# Altium schematic sheet led.SchDoc
size A0
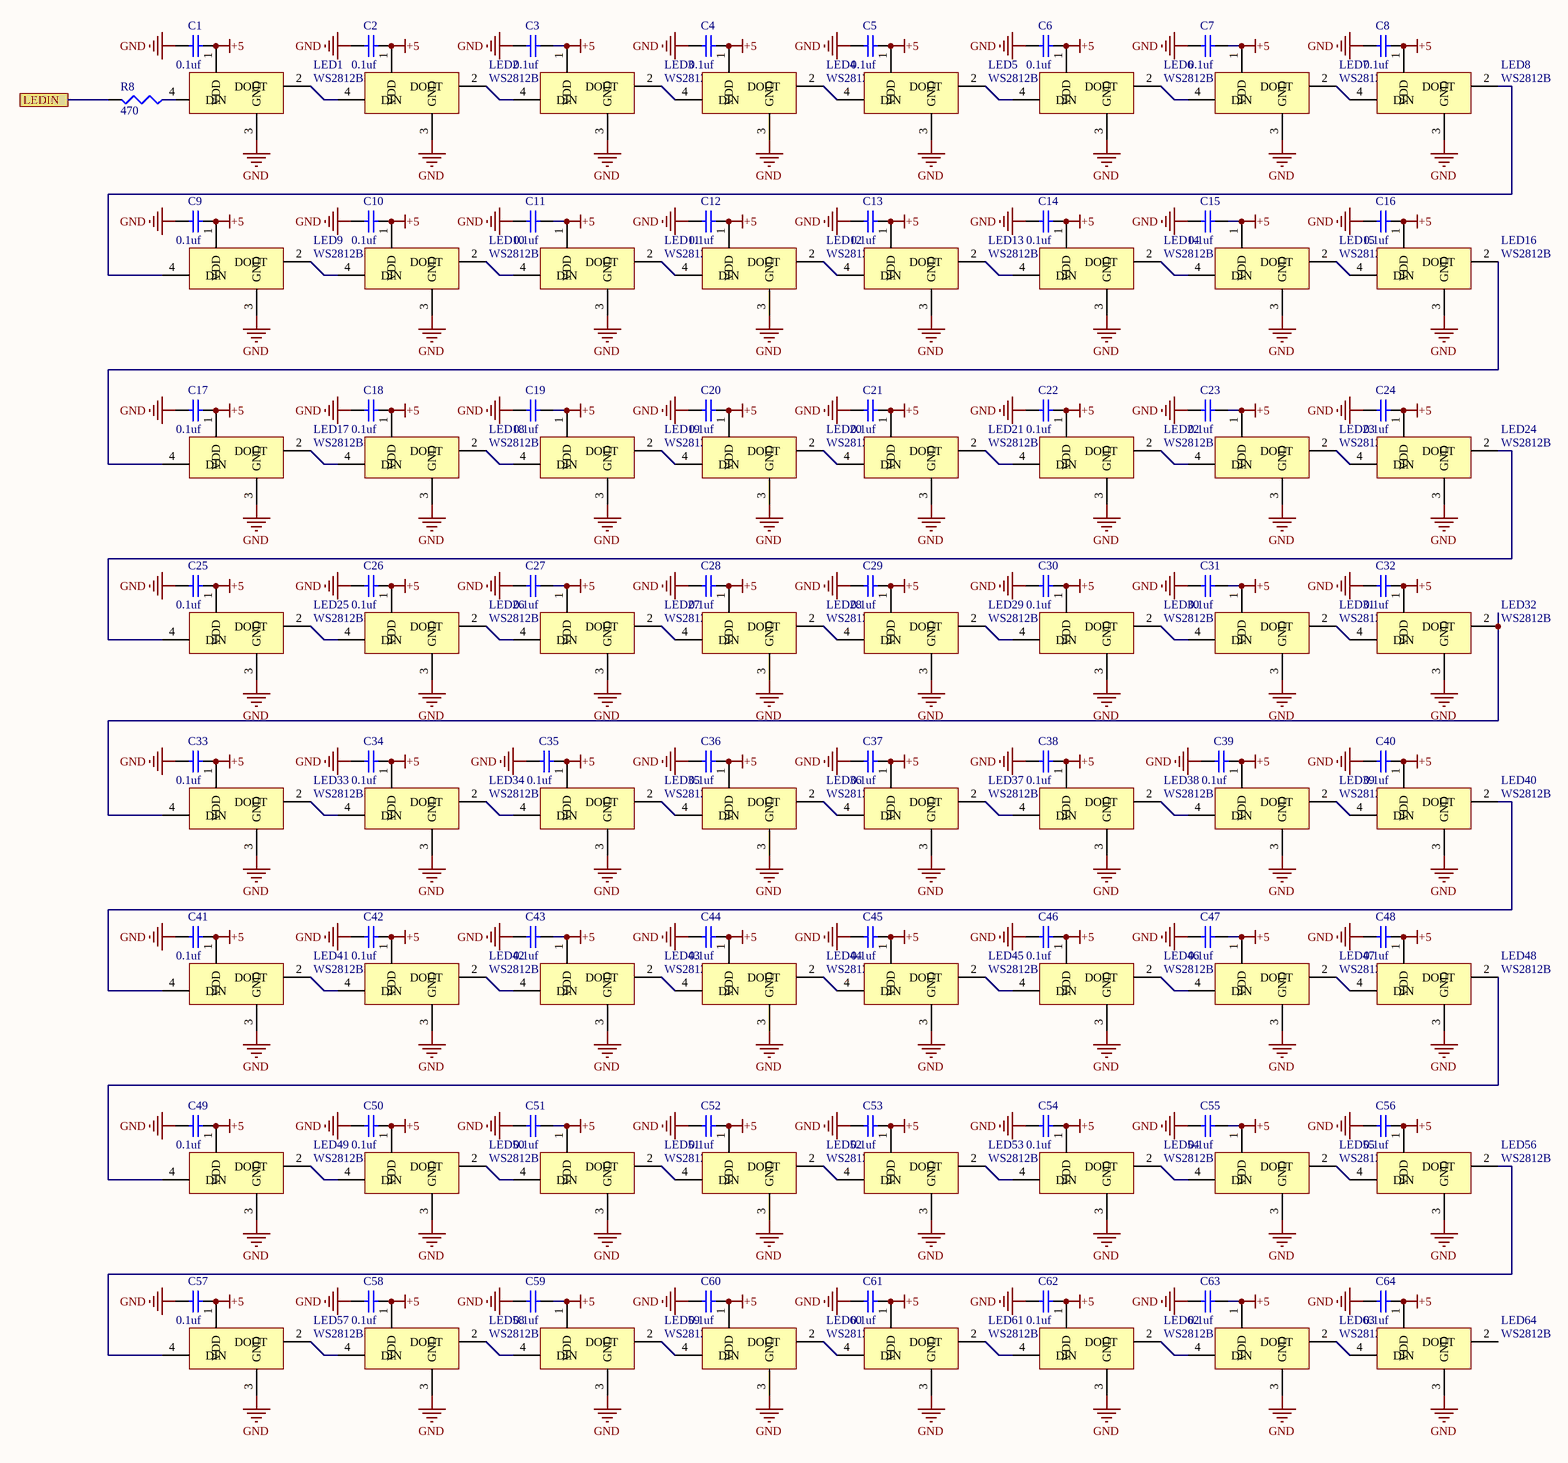
[diagram p0: led.SchDoc]

## Parts
C1  value 0.1uf  [C1206]  (hidden comment: Cap Semi)
C2  value 0.1uf  [C1206]  (hidden comment: Cap Semi)
C3  value 0.1uf  [C1206]  (hidden comment: Cap Semi)
C4  value 0.1uf  [C1206]  (hidden comment: Cap Semi)
C5  value 0.1uf  [C1206]  (hidden comment: Cap Semi)
C6  value 0.1uf  [C1206]  (hidden comment: Cap Semi)
C7  value 0.1uf  [C1206]  (hidden comment: Cap Semi)
C8  value 0.1uf  [C1206]  (hidden comment: Cap Semi)
C9  value 0.1uf  [C1206]  (hidden comment: Cap Semi)
C10  value 0.1uf  [C1206]  (hidden comment: Cap Semi)
C11  value 0.1uf  [C1206]  (hidden comment: Cap Semi)
C12  value 0.1uf  [C1206]  (hidden comment: Cap Semi)
C13  value 0.1uf  [C1206]  (hidden comment: Cap Semi)
C14  value 0.1uf  [C1206]  (hidden comment: Cap Semi)
C15  value 0.1uf  [C1206]  (hidden comment: Cap Semi)
C16  value 0.1uf  [C1206]  (hidden comment: Cap Semi)
C17  value 0.1uf  [C1206]  (hidden comment: Cap Semi)
C18  value 0.1uf  [C1206]  (hidden comment: Cap Semi)
C19  value 0.1uf  [C1206]  (hidden comment: Cap Semi)
C20  value 0.1uf  [C1206]  (hidden comment: Cap Semi)
C21  value 0.1uf  [C1206]  (hidden comment: Cap Semi)
C22  value 0.1uf  [C1206]  (hidden comment: Cap Semi)
C23  value 0.1uf  [C1206]  (hidden comment: Cap Semi)
C24  value 0.1uf  [C1206]  (hidden comment: Cap Semi)
C25  value 0.1uf  [C1206]  (hidden comment: Cap Semi)
C26  value 0.1uf  [C1206]  (hidden comment: Cap Semi)
C27  value 0.1uf  [C1206]  (hidden comment: Cap Semi)
C28  value 0.1uf  [C1206]  (hidden comment: Cap Semi)
C29  value 0.1uf  [C1206]  (hidden comment: Cap Semi)
C30  value 0.1uf  [C1206]  (hidden comment: Cap Semi)
C31  value 0.1uf  [C1206]  (hidden comment: Cap Semi)
C32  value 0.1uf  [C1206]  (hidden comment: Cap Semi)
C33  value 0.1uf  [C1206]  (hidden comment: Cap Semi)
C34  value 0.1uf  [C1206]  (hidden comment: Cap Semi)
C35  value 0.1uf  [C1206]  (hidden comment: Cap Semi)
C36  value 0.1uf  [C1206]  (hidden comment: Cap Semi)
C37  value 0.1uf  [C1206]  (hidden comment: Cap Semi)
C38  value 0.1uf  [C1206]  (hidden comment: Cap Semi)
C39  value 0.1uf  [C1206]  (hidden comment: Cap Semi)
C40  value 0.1uf  [C1206]  (hidden comment: Cap Semi)
C41  value 0.1uf  [C1206]  (hidden comment: Cap Semi)
C42  value 0.1uf  [C1206]  (hidden comment: Cap Semi)
C43  value 0.1uf  [C1206]  (hidden comment: Cap Semi)
C44  value 0.1uf  [C1206]  (hidden comment: Cap Semi)
C45  value 0.1uf  [C1206]  (hidden comment: Cap Semi)
C46  value 0.1uf  [C1206]  (hidden comment: Cap Semi)
C47  value 0.1uf  [C1206]  (hidden comment: Cap Semi)
C48  value 0.1uf  [C1206]  (hidden comment: Cap Semi)
C49  value 0.1uf  [C1206]  (hidden comment: Cap Semi)
C50  value 0.1uf  [C1206]  (hidden comment: Cap Semi)
C51  value 0.1uf  [C1206]  (hidden comment: Cap Semi)
C52  value 0.1uf  [C1206]  (hidden comment: Cap Semi)
C53  value 0.1uf  [C1206]  (hidden comment: Cap Semi)
C54  value 0.1uf  [C1206]  (hidden comment: Cap Semi)
C55  value 0.1uf  [C1206]  (hidden comment: Cap Semi)
C56  value 0.1uf  [C1206]  (hidden comment: Cap Semi)
C57  value 0.1uf  [C1206]  (hidden comment: Cap Semi)
C58  value 0.1uf  [C1206]  (hidden comment: Cap Semi)
C59  value 0.1uf  [C1206]  (hidden comment: Cap Semi)
C60  value 0.1uf  [C1206]  (hidden comment: Cap Semi)
C61  value 0.1uf  [C1206]  (hidden comment: Cap Semi)
C62  value 0.1uf  [C1206]  (hidden comment: Cap Semi)
C63  value 0.1uf  [C1206]  (hidden comment: Cap Semi)
C64  value 0.1uf  [C1206]  (hidden comment: Cap Semi)
LED1  WS2812B  [WS2812B]
LED2  WS2812B  [WS2812B]
LED3  WS2812B  [WS2812B]
LED4  WS2812B  [WS2812B]
LED5  WS2812B  [WS2812B]
LED6  WS2812B  [WS2812B]
LED7  WS2812B  [WS2812B]
LED8  WS2812B  [WS2812B]
LED9  WS2812B  [WS2812B]
LED10  WS2812B  [WS2812B]
LED11  WS2812B  [WS2812B]
LED12  WS2812B  [WS2812B]
LED13  WS2812B  [WS2812B]
LED14  WS2812B  [WS2812B]
LED15  WS2812B  [WS2812B]
LED16  WS2812B  [WS2812B]
LED17  WS2812B  [WS2812B]
LED18  WS2812B  [WS2812B]
LED19  WS2812B  [WS2812B]
LED20  WS2812B  [WS2812B]
LED21  WS2812B  [WS2812B]
LED22  WS2812B  [WS2812B]
LED23  WS2812B  [WS2812B]
LED24  WS2812B  [WS2812B]
LED25  WS2812B  [WS2812B]
LED26  WS2812B  [WS2812B]
LED27  WS2812B  [WS2812B]
LED28  WS2812B  [WS2812B]
LED29  WS2812B  [WS2812B]
LED30  WS2812B  [WS2812B]
LED31  WS2812B  [WS2812B]
LED32  WS2812B  [WS2812B]
LED33  WS2812B  [WS2812B]
LED34  WS2812B  [WS2812B]
LED35  WS2812B  [WS2812B]
LED36  WS2812B  [WS2812B]
LED37  WS2812B  [WS2812B]
LED38  WS2812B  [WS2812B]
LED39  WS2812B  [WS2812B]
LED40  WS2812B  [WS2812B]
LED41  WS2812B  [WS2812B]
LED42  WS2812B  [WS2812B]
LED43  WS2812B  [WS2812B]
LED44  WS2812B  [WS2812B]
LED45  WS2812B  [WS2812B]
LED46  WS2812B  [WS2812B]
LED47  WS2812B  [WS2812B]
LED48  WS2812B  [WS2812B]
LED49  WS2812B  [WS2812B]
LED50  WS2812B  [WS2812B]
LED51  WS2812B  [WS2812B]
LED52  WS2812B  [WS2812B]
LED53  WS2812B  [WS2812B]
LED54  WS2812B  [WS2812B]
LED55  WS2812B  [WS2812B]
LED56  WS2812B  [WS2812B]
LED57  WS2812B  [WS2812B]
LED58  WS2812B  [WS2812B]
LED59  WS2812B  [WS2812B]
LED60  WS2812B  [WS2812B]
LED61  WS2812B  [WS2812B]
LED62  WS2812B  [WS2812B]
LED63  WS2812B  [WS2812B]
LED64  WS2812B  [WS2812B]
R8  value 470  [C1206]  (hidden comment: res)

## Ports
LEDIN

## Nets
+5: C1.2 C2.2 C3.2 C4.2 C5.2 C6.2 C7.2 C8.2 C9.2 C10.2 C11.2 C12.2 C13.2 C14.2 C15.2 C16.2 C17.2 C18.2 C19.2 C20.2 C21.2 C22.2 C23.2 C24.2 C25.2 C26.2 C27.2 C28.2 C29.2 C30.2 C31.2 C32.2 C33.2 C34.2 C35.2 C36.2 C37.2 C38.2 C39.2 C40.2 C41.2 C42.2 C43.2 C44.2 C45.2 C46.2 C47.2 C48.2 C49.2 C50.2 C51.2 C52.2 C53.2 C54.2 C55.2 C56.2 C57.2 C58.2 C59.2 C60.2 C61.2 C62.2 C63.2 C64.2 LED1.1(VDD) LED2.1(VDD) LED3.1(VDD) LED4.1(VDD) LED5.1(VDD) LED6.1(VDD) LED7.1(VDD) LED8.1(VDD) LED9.1(VDD) LED10.1(VDD) LED11.1(VDD) LED12.1(VDD) LED13.1(VDD) LED14.1(VDD) LED15.1(VDD) LED16.1(VDD) LED17.1(VDD) LED18.1(VDD) LED19.1(VDD) LED20.1(VDD) LED21.1(VDD) LED22.1(VDD) LED23.1(VDD) LED24.1(VDD) LED25.1(VDD) LED26.1(VDD) LED27.1(VDD) LED28.1(VDD) LED29.1(VDD) LED30.1(VDD) LED31.1(VDD) LED32.1(VDD) LED33.1(VDD) LED34.1(VDD) LED35.1(VDD) LED36.1(VDD) LED37.1(VDD) LED38.1(VDD) LED39.1(VDD) LED40.1(VDD) LED41.1(VDD) LED42.1(VDD) LED43.1(VDD) LED44.1(VDD) LED45.1(VDD) LED46.1(VDD) LED47.1(VDD) LED48.1(VDD) LED49.1(VDD) LED50.1(VDD) LED51.1(VDD) LED52.1(VDD) LED53.1(VDD) LED54.1(VDD) LED55.1(VDD) LED56.1(VDD) LED57.1(VDD) LED58.1(VDD) LED59.1(VDD) LED60.1(VDD) LED61.1(VDD) LED62.1(VDD) LED63.1(VDD) LED64.1(VDD)
GND: C1.1 C2.1 C3.1 C4.1 C5.1 C6.1 C7.1 C8.1 C9.1 C10.1 C11.1 C12.1 C13.1 C14.1 C15.1 C16.1 C17.1 C18.1 C19.1 C20.1 C21.1 C22.1 C23.1 C24.1 C25.1 C26.1 C27.1 C28.1 C29.1 C30.1 C31.1 C32.1 C33.1 C34.1 C35.1 C36.1 C37.1 C38.1 C39.1 C40.1 C41.1 C42.1 C43.1 C44.1 C45.1 C46.1 C47.1 C48.1 C49.1 C50.1 C51.1 C52.1 C53.1 C54.1 C55.1 C56.1 C57.1 C58.1 C59.1 C60.1 C61.1 C62.1 C63.1 C64.1 LED1.3(GND) LED2.3(GND) LED3.3(GND) LED4.3(GND) LED5.3(GND) LED6.3(GND) LED7.3(GND) LED8.3(GND) LED9.3(GND) LED10.3(GND) LED11.3(GND) LED12.3(GND) LED13.3(GND) LED14.3(GND) LED15.3(GND) LED16.3(GND) LED17.3(GND) LED18.3(GND) LED19.3(GND) LED20.3(GND) LED21.3(GND) LED22.3(GND) LED23.3(GND) LED24.3(GND) LED25.3(GND) LED26.3(GND) LED27.3(GND) LED28.3(GND) LED29.3(GND) LED30.3(GND) LED31.3(GND) LED32.3(GND) LED33.3(GND) LED34.3(GND) LED35.3(GND) LED36.3(GND) LED37.3(GND) LED38.3(GND) LED39.3(GND) LED40.3(GND) LED41.3(GND) LED42.3(GND) LED43.3(GND) LED44.3(GND) LED45.3(GND) LED46.3(GND) LED47.3(GND) LED48.3(GND) LED49.3(GND) LED50.3(GND) LED51.3(GND) LED52.3(GND) LED53.3(GND) LED54.3(GND) LED55.3(GND) LED56.3(GND) LED57.3(GND) LED58.3(GND) LED59.3(GND) LED60.3(GND) LED61.3(GND) LED62.3(GND) LED63.3(GND) LED64.3(GND)
LEDIN: R8.2 ; port LEDIN
NetLED1_2: LED1.2(DOUT) LED2.4(DIN)
NetLED1_4: LED1.4(DIN) R8.1
NetLED2_2: LED2.2(DOUT) LED3.4(DIN)
NetLED3_2: LED3.2(DOUT) LED4.4(DIN)
NetLED4_2: LED4.2(DOUT) LED5.4(DIN)
NetLED5_2: LED5.2(DOUT) LED6.4(DIN)
NetLED6_2: LED6.2(DOUT) LED7.4(DIN)
NetLED7_2: LED7.2(DOUT) LED8.4(DIN)
NetLED8_2: LED8.2(DOUT) LED9.4(DIN)
NetLED9_2: LED9.2(DOUT) LED10.4(DIN)
NetLED10_2: LED10.2(DOUT) LED11.4(DIN)
NetLED11_2: LED11.2(DOUT) LED12.4(DIN)
NetLED12_2: LED12.2(DOUT) LED13.4(DIN)
NetLED13_2: LED13.2(DOUT) LED14.4(DIN)
NetLED14_2: LED14.2(DOUT) LED15.4(DIN)
NetLED15_2: LED15.2(DOUT) LED16.4(DIN)
NetLED16_2: LED16.2(DOUT) LED17.4(DIN)
NetLED17_2: LED17.2(DOUT) LED18.4(DIN)
NetLED18_2: LED18.2(DOUT) LED19.4(DIN)
NetLED19_2: LED19.2(DOUT) LED20.4(DIN)
NetLED20_2: LED20.2(DOUT) LED21.4(DIN)
NetLED21_2: LED21.2(DOUT) LED22.4(DIN)
NetLED22_2: LED22.2(DOUT) LED23.4(DIN)
NetLED23_2: LED23.2(DOUT) LED24.4(DIN)
NetLED24_2: LED24.2(DOUT) LED25.4(DIN)
NetLED25_2: LED25.2(DOUT) LED26.4(DIN)
NetLED26_2: LED26.2(DOUT) LED27.4(DIN)
NetLED27_2: LED27.2(DOUT) LED28.4(DIN)
NetLED28_2: LED28.2(DOUT) LED29.4(DIN)
NetLED29_2: LED29.2(DOUT) LED30.4(DIN)
NetLED30_2: LED30.2(DOUT) LED31.4(DIN)
NetLED31_2: LED31.2(DOUT) LED32.4(DIN)
NetLED32_2: LED32.2(DOUT) LED33.4(DIN)
NetLED33_2: LED33.2(DOUT) LED34.4(DIN)
NetLED34_2: LED34.2(DOUT) LED35.4(DIN)
NetLED35_2: LED35.2(DOUT) LED36.4(DIN)
NetLED36_2: LED36.2(DOUT) LED37.4(DIN)
NetLED37_2: LED37.2(DOUT) LED38.4(DIN)
NetLED38_2: LED38.2(DOUT) LED39.4(DIN)
NetLED39_2: LED39.2(DOUT) LED40.4(DIN)
NetLED40_2: LED40.2(DOUT) LED41.4(DIN)
NetLED41_2: LED41.2(DOUT) LED42.4(DIN)
NetLED42_2: LED42.2(DOUT) LED43.4(DIN)
NetLED43_2: LED43.2(DOUT) LED44.4(DIN)
NetLED44_2: LED44.2(DOUT) LED45.4(DIN)
NetLED45_2: LED45.2(DOUT) LED46.4(DIN)
NetLED46_2: LED46.2(DOUT) LED47.4(DIN)
NetLED47_2: LED47.2(DOUT) LED48.4(DIN)
NetLED48_2: LED48.2(DOUT) LED49.4(DIN)
NetLED49_2: LED49.2(DOUT) LED50.4(DIN)
NetLED50_2: LED50.2(DOUT) LED51.4(DIN)
NetLED51_2: LED51.2(DOUT) LED52.4(DIN)
NetLED52_2: LED52.2(DOUT) LED53.4(DIN)
NetLED53_2: LED53.2(DOUT) LED54.4(DIN)
NetLED54_2: LED54.2(DOUT) LED55.4(DIN)
NetLED55_2: LED55.2(DOUT) LED56.4(DIN)
NetLED56_2: LED56.2(DOUT) LED57.4(DIN)
NetLED57_2: LED57.2(DOUT) LED58.4(DIN)
NetLED58_2: LED58.2(DOUT) LED59.4(DIN)
NetLED59_2: LED59.2(DOUT) LED60.4(DIN)
NetLED60_2: LED60.2(DOUT) LED61.4(DIN)
NetLED61_2: LED61.2(DOUT) LED62.4(DIN)
NetLED62_2: LED62.2(DOUT) LED63.4(DIN)
NetLED63_2: LED63.2(DOUT) LED64.4(DIN)

Not connected (* = marked no-connect by the designer): LED64 2(DOUT)

## Library data of the parts
C1-C64 = Cap Semi: Capacitor (Semiconductor SIM Model); Published: 8-Jun-2000; LatestRevisionDate: 29-May-2009; LatestRevisionNote: IPC-7351 Footprint Added.; PackageReference: C1206; Publisher: Altium Limited; PackageDescription: Chip Capacitor
LED1-LED64 = WS2812B: 3535
R8 = Res3: Resistor; Published: 8-Jun-2000; LatestRevisionDate: 29-May-2009; LatestRevisionNote: IPC-7351 Footprint Added.; PackageReference: J1-0603; Publisher: Altium Limited; PackageDescription: Chip Resistor